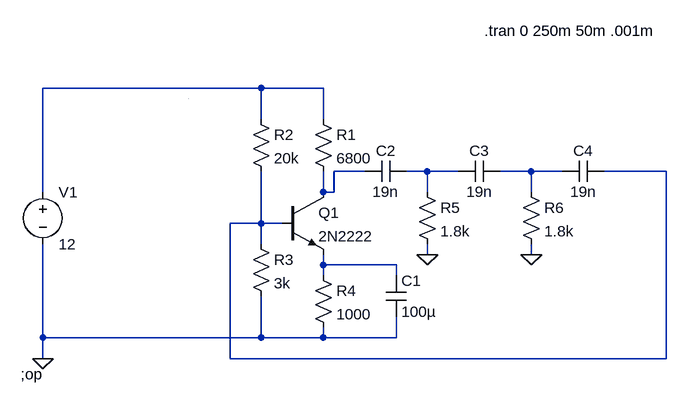
[diagram p0: schematic Draft1.asc]
Draft1.asc, the LTspice schematic file:
Version 4
SHEET 1 880 680
WIRE 112 -16 -224 -16
WIRE 208 -16 112 -16
WIRE 112 32 112 -16
WIRE 208 32 208 -16
WIRE 272 112 224 112
WIRE 368 112 336 112
WIRE 416 112 368 112
WIRE 528 112 480 112
WIRE 576 112 528 112
WIRE 736 112 640 112
WIRE -224 144 -224 -16
WIRE 208 144 208 112
WIRE 224 144 224 112
WIRE 224 144 208 144
WIRE 368 144 368 112
WIRE 528 144 528 112
WIRE 112 192 112 112
WIRE 112 192 64 192
WIRE 144 192 112 192
WIRE 112 224 112 192
WIRE 368 240 368 224
WIRE 528 240 528 224
WIRE 208 256 208 240
WIRE 320 256 208 256
WIRE 208 272 208 256
WIRE 320 272 320 256
WIRE -224 368 -224 224
WIRE 112 368 112 304
WIRE 112 368 -224 368
WIRE 208 368 208 352
WIRE 208 368 112 368
WIRE 320 368 320 336
WIRE 320 368 208 368
WIRE -224 400 -224 368
WIRE 64 400 64 192
WIRE 736 400 736 112
WIRE 736 400 64 400
WIRE 0 0 0 0
FLAG -224 400 0
FLAG 368 240 0
FLAG 528 240 0
SYMBOL npn 144 144 R0
SYMATTR InstName Q1
SYMATTR Value 2N2222
SYMBOL res 192 16 R0
SYMATTR InstName R1
SYMATTR Value 6800
SYMBOL res 96 16 R0
SYMATTR InstName R2
SYMATTR Value 20k
SYMBOL res 96 208 R0
SYMATTR InstName R3
SYMATTR Value 3k
SYMBOL res 192 256 R0
SYMATTR InstName R4
SYMATTR Value 1000
SYMBOL voltage -224 128 R0
WINDOW 123 0 0 Left 2
WINDOW 39 0 0 Left 2
SYMATTR InstName V1
SYMATTR Value 12
SYMBOL cap 304 272 R0
SYMATTR InstName C1
SYMATTR Value 100µ
SYMBOL cap 336 96 R90
WINDOW 0 0 32 VBottom 2
WINDOW 3 32 32 VTop 2
SYMATTR InstName C2
SYMATTR Value 19n
SYMBOL res 352 128 R0
SYMATTR InstName R5
SYMATTR Value 1.8k
SYMBOL cap 480 96 R90
WINDOW 0 0 32 VBottom 2
WINDOW 3 32 32 VTop 2
SYMATTR InstName C3
SYMATTR Value 19n
SYMBOL res 512 128 R0
SYMATTR InstName R6
SYMATTR Value 1.8k
SYMBOL cap 640 96 R90
WINDOW 0 0 32 VBottom 2
WINDOW 3 32 32 VTop 2
SYMATTR InstName C4
SYMATTR Value 19n
TEXT -258 424 Left 2 !;op
TEXT 456 -104 Left 2 !.tran 0 250m 50m .001m

The netlist it stands for:
* Draft1.asc
Q1 N002 N005 N006 0 2N2222
R1 N001 N002 6800
R2 N001 N005 20k
R3 N005 0 3k
R4 N006 0 1000
V1 N001 0 12
C1 N006 0 100µ
C2 N003 N002 19n
R5 N003 0 1.8k
C3 N004 N003 19n
R6 N004 0 1.8k
C4 N005 N004 19n
.model NPN NPN
.model PNP PNP
.lib standard.bjt
;op
.tran 0 250m 50m .001m
.backanno
.end